# EAGLE schematic Set-Mile-PPG-Module (EAGLE 9.5.2)
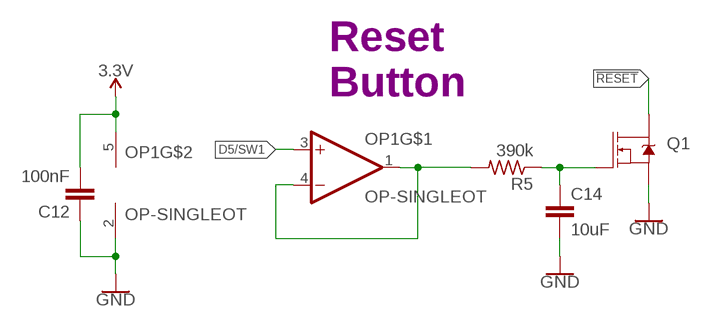
[diagram p0: schematic, sheet 1]

## Parts
C12  100nF  CAPACITOR0603  [C0603]
C14  10uF  CAPACITOR0805  [C0805]
OP1  OP-SINGLEOT  [SOT23-5]
Q1  5.8A/30V/35mΩ  NFET-AO3404A  [SOT23-3]
R5  390k  RESISTOR0603  [R0603]

## Nets
3V: C12.2 OP1.5(V+) ; supply symbol labelled 3.3V
!RESET: Q1.3(D)
D5/SW1: OP1.3(+IN)
GND: C12.1 C14.2 OP1.2(V-) Q1.2(S)
N$7: OP1.1(OUT) OP1.4(-IN) R5.2
N$17: C14.1 Q1.1(G) R5.1

## Notes on the sheet
- Reset
  Button

## Library data of the parts
C12 C14 = LinnesLab-Passives:CAPACITOR
OP1 = LinnesLab-AnalogIC:OP-SINGLE: Single Op Amp 2.7V to 6.0V Single Supply CMOS Source: http://ww1.microchip.com/downloads/en/DeviceDoc/21314g.pdf
Q1 = LinnesLab-DiscreteSemi:NFET: N-channel MOSFETs Voltage controlled devices that allow control of high current outputs. SparkFun Products: SparkFun OpenScale <https://www.sparkfun.com/products/13261> SparkFun Digital Sandbox <https://www.sparkfun.com/products/12651> SparkFun Monster Moto Shield <https://www.sparkfun.com/products/10182> SparkFun MOSFET Power Controller <https://www.sparkfun.com/products/11214>
R5 = LinnesLab-Passives:RESISTOR